# Altium project Khoi_Node.PrjPCB
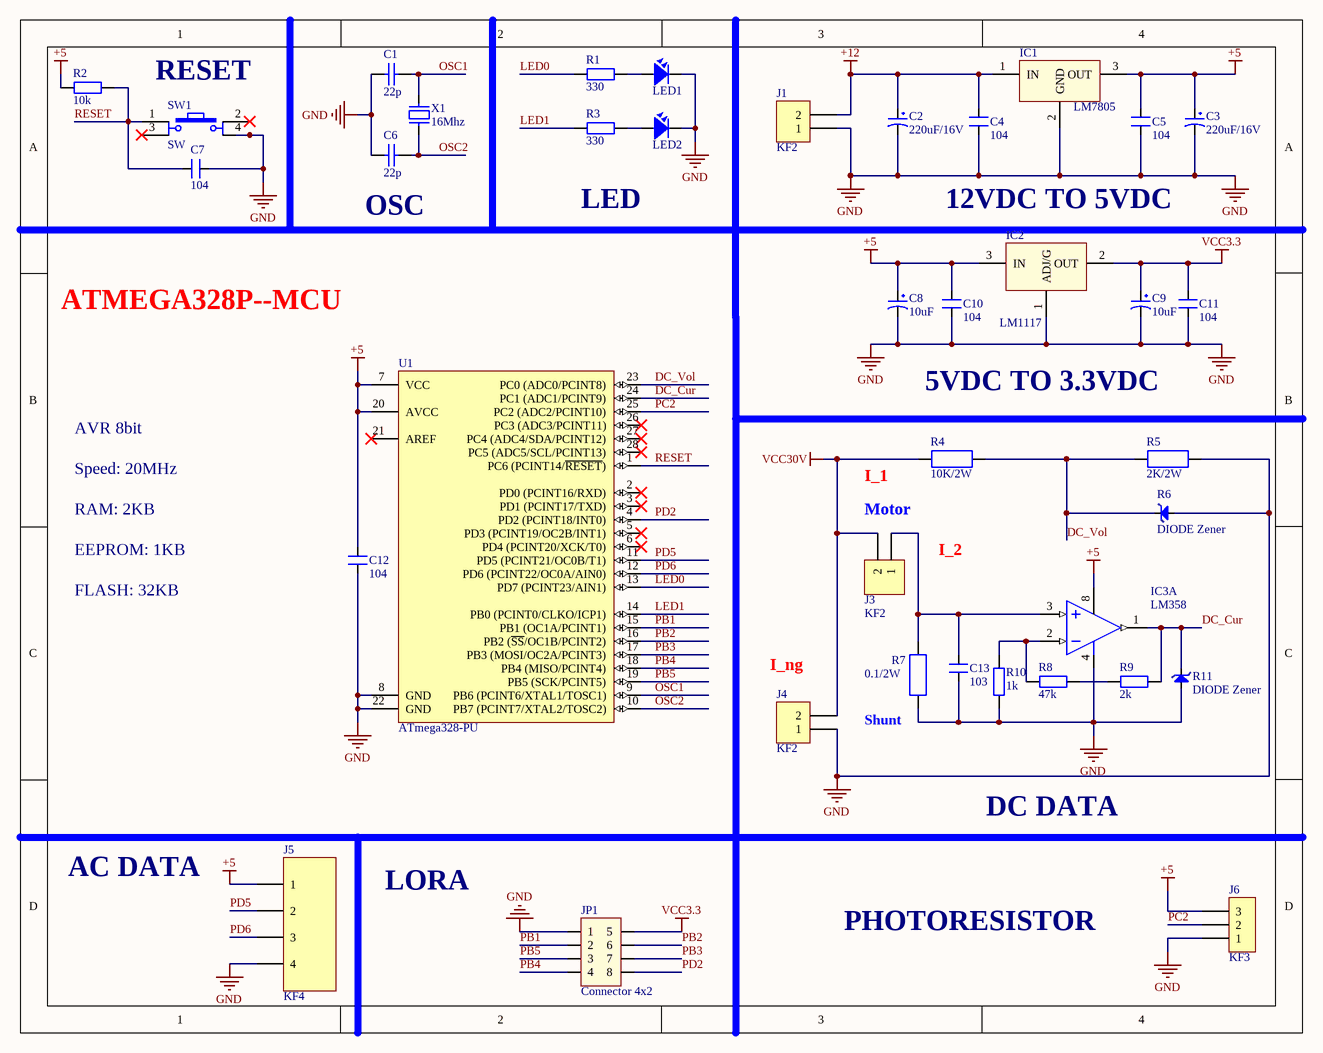
[diagram p0: File_Nguyen_ly.SchDoc]
1 sheet, 38 parts. Net scope: global (net labels, ports and power ports of the same name join across sheets).
Board file: File_Mach_In.PcbDoc

## Sheet File_Nguyen_ly.SchDoc
size A

### Parts
C1  value 22p  [Tu-pico]  (hidden comment: Capacitor Ceramic)
C2  220uF/16V  [CP1.5/3.4]
C3  220uF/16V  [CP1.5/3.4]
C4  104  [CN2]
C5  104  [CN2]
C6  value 22p  [Tu-pico]  (hidden comment: Capacitor Ceramic)
C7  104  [CN2]
C8  10uF  [CP1/2]
C9  10uF  [CP1/2]
C10  104  [CN2]
C11  104  [CN2]
C12  104  [CN2]
C13  103  [CN1.5]
IC1  LM7805  [QTO-220]
IC2  LM1117  [SOT223-4N]
IC3  LM358  [DIP8/W0.3]  (part A of 2)
J1  KF2  [KF2-5.08]
J3  KF2  [KF2-5.08]
J4  KF2  [KF2-5.08]
J5  KF4  [KF4-5]
J6  KF3  [KF3-5.08]
JP1  Connector 4x2  [JP4x2]
LED1  LED  [LED-5-Yellow]  (value not drawn)
LED2  LED  [LED-5-BLUE]  (value not drawn)
R1  330  [R1/4W]
R2  10k  [R1/4W]
R3  330  [R1/4W]
R4  10K/2W  [R2W]
R5  2K/2W  [R2W]
R6  DIODE Zener  [DIO-2A-ZEN]
R7  0.1/2W  [R2W]
R8  47k  [R1/4W]
R9  2k  [R1/4W]
R10  1k  [R1/4W]
R11  DIODE Zener  [DIO-2A-ZEN]
SW1  SW  [SW4]
U1  ATmega328-PU  [DIP28]
X1  16Mhz  [XT2]

### Nets
+5: C3.1 C5.2 C8.1 C10.2 C12.2 IC1.3(OUT) IC2.3(IN) IC3.8(+V) J5.1 J6.3 R2.2 U1.7(VCC) U1.20(AVCC)
+12: C2.1 C4.2 IC1.1(IN) J1.2
GND: C1.1 C2.2 C3.2 C4.1 C5.1 C6.1 C7.2 C8.2 C9.2 C10.1 C11.1 C12.1 C13.1 IC1.2(GND) IC2.1(ADJ/G) IC3.4(-V) J1.1 J4.1 J5.4 J6.1 JP1.1 LED1.2 LED2.2 R5.1 R6.1(A) R7.1 R10.1 R11.1(A) SW1.4 U1.8(GND) U1.22(GND)
VCC3.3: C9.1 C11.2 IC2.2(OUT) JP1.5
VCC30V: J3.2 J4.2 R4.2
DC_Cur: IC3.1(OUT) R9.2 R11.2(K) U1.24(PC1_(ADC1/PCINT9))
DC_Vol: R4.1 R5.2 R6.2(K) U1.23(PC0_(ADC0/PCINT8))
LED0: R1.1 U1.13(PD7_(PCINT23/AIN1))
LED1: R3.1 U1.14(PB0_(PCINT0/CLKO/ICP1))
OSC1: C1.2 U1.9(PB6_(PCINT6/XTAL1/TOSC1)) X1.2
OSC2: C6.2 U1.10(PB7_(PCINT7/XTAL2/TOSC2)) X1.1
PB1: JP1.2 U1.15(PB1_(OC1A/PCINT1))
PB2: JP1.6 U1.16(PB2_(~{SS}/OC1B/PCINT2))
PB3: JP1.7 U1.17(PB3_(MOSI/OC2A/PCINT3))
PB4: JP1.4 U1.18(PB4_(MISO/PCINT4))
PB5: JP1.3 U1.19(PB5_(SCK/PCINT5))
PC2: J6.2 U1.25(PC2_(ADC2/PCINT10))
PD2: JP1.8 U1.4(PD2_(PCINT18/INT0))
PD5: J5.2 U1.11(PD5_(PCINT21/OC0B/T1))
PD6: J5.3 U1.12(PD6_(PCINT22/OC0A/AIN0))
RESET: C7.1 R2.1 SW1.1 U1.1(PC6_(PCINT14/~{RESET}))
NetC13_2: C13.2 IC3.3(IN+) J3.1 R7.2
NetIC3_2: IC3.2(IN-) R8.1 R10.2
NetLED1_1: LED1.1 R1.2
NetLED2_1: LED2.1 R3.2
NetR8_2: R8.2 R9.1

Not connected (* = marked no-connect by the designer): SW1 2* 3*; U1 2(PD0_(PCINT16/RXD))* 3(PD1_(PCINT17/TXD))* 5(PD3_(PCINT19/OC2B/INT1))* 6(PD4_(PCINT20/XCK/T0))* 21(AREF)* 26(PC3_(ADC3/PCINT11))* 27(PC4_(ADC4/SDA/PCINT12))* 28(PC5_(ADC5/SCL/PCINT13))*

### Notes on the sheet
- RESET
- (near C6) OSC
- LED
- 12VDC TO 5VDC
- ATMEGA328P--MCU
- AVR 8bit
- 5VDC TO 3.3VDC
- Speed: 20MHz
- RAM: 2KB
- Motor
- (near R4) I_1
- EEPROM: 1KB
- (near J3) I_2
- FLASH: 32KB
- (near J4) I_ng
- (near R7) Shunt
- DC DATA
- AC DATA
- LORA
- PHOTORESISTOR

### Library data of the parts
C1 C6 = CapCeramic: Capacitor; Published: 8-Jun-2000; LatestRevisionDate: 17-Jul-2002; LatestRevisionNote: Re-released for DXP Platform.; PackageReference: RAD-0.3; Publisher: Altium Limited
C2 C3 = CP3: Cap 100uF/35V - 470uF/16V; Value: 100uF/35V/50V; Description 1: 1000uF/6,3V - 470uF/16V - 330uF - 25V; Description 2: 220uF/35V - 100uF/50V - 63V - 4,7uF/200V; Description 3: 22uF => 33uF100V - 3,3uF => 4,7uF/250V; Description 4: 2,2uF =>3,3uF/350 - 2,2uF/400V - 1uF/450V
C4 C5 C7 C10-C12 = CN2: Cap np 104 => 105pF; Value: 0.1uF
C8 C9 = CP1: Cap P  0,1uF < 22uF , 16 - 50V; Value: 10uF/50V; Description 1: 10 => 220uF/6,3V/10V - 10uF => 100uF/16V; Description 2: 0,1uF => 33uF/50V - 10uF => 22uF/63V; Description 3: 0,47uF => 10uF/100V
C13 = CN1.5: Cap np 682pF => 104pF; Value: 0.01uF
IC1 = LM78xx: On ap +, from + 5 to + 24VDC; Value: LM7805
IC2 = LM1117: Available in 1.8V, 2.5V, 2.85V, 3.3V, 5V, and  Adjustable Versions; Value: LM317
IC3 = LM358: Low-Power Dual Operational Amplifier; Value: LM358
J1 J3 J4 = KF2: Manufacturer: Würth Elektronik eiSos GmbH; partNo: 691103110002; ComponentLink1 Description: Manufacturer; ComponentLink2 Description: Datasheet; NoPins: 2; Created Date: 29 October 2013; ComponentLink1URL: http://www.we-online.com; ComponentLink2URL: http://katalog.we-online.de/em/datasheet/6911031100xx.pdf; Created by: Karrer Zheng
J5 = KF4: Manufacturer: W¨¹rth Elektronik eiSos GmbH; PartNo: 691133710004; ComponentLink1 Description: Manufacturer; ComponentLink2 Description: Datasheet; NoPins: 4; ComponentLink1 URL: http://www.we-online.com; ComponentLink2 URL: http://katalog.we-online.de/em/datasheet/6911337100xx.pdf; Created By: Baojun Chen; Created Date: 4-Aug-15
J6 = KF3: Manufacturer: Würth Elektronik eiSos GmbH; partNo: 691103110003; ComponentLink1 Description: Manufacturer; ComponentLink2 Description: Datasheet; NoPins: 3; Created Date: 29 October 2013; ComponentLink1URL: http://www.we-online.com; ComponentLink2URL: http://katalog.we-online.de/em/datasheet/6911031100xx.pdf; Created by: Karrer Zheng
JP1 = JP4x2: Value: Connector 4x2
LED1 LED2 = LED: LED Single colour Green and Red; Value: LED 3 ly Single Colour
R1-R3 R8-R10 = R1/4W: Resistor 1/4W; Value: R1/4W - 1K
R4 R5 R7 = R2W: Resistor 2W; Value: R2W - 47
R6 R11 = DIODE Zener: Zenner
SW1 = SW4: Switch button 4 pin; Value: Button chip 4 pin
U1 = ATmega328-PU: 8-bit AVR Microcontroller, 32KB Flash, 1KB EEPROM, 2KB SRAM, 28-pin PDIP, Industrial Grade (-40°C to 85°C); Published: 1-Apr-2010; DatasheetVersion: revA, Jan-2010; PackageVersion: revB, Sep-2001; PackageReference: 28P3; Publisher: Altium Limited; PackageDescription: 28-lead (0.300"/7.62mm Wide) Plastic Dual Inline Package (PDIP); Supplier 1: Digi-Key; Supplier Part Number 1: ATMEGA328-PU-ND; Supplier 2: Mouser; Supplier Part Number 2: 556-ATMEGA328-PU; ComponentLink1Description: Manufacturer Link; ComponentLink1URL: http://www.atmel.com/products/avr/default.asp?; ComponentLink2Description: ATmega48A/48PA/88A/88PA/168A/168PA/328/328P Datasheet; ComponentLink2URL: http://www.atmel.com/dyn/resources/prod_documents/8271.pdf; ComponentLink3Description: ATmega48A/48PA/88A/88PA/168A/168PA/328/328P Summary; ComponentLink3URL: http://www.atmel.com/dyn/resources/prod_documents/8271S.pdf; ComponentLink4Description: Atmel.com Home; ComponentLink4URL: http://www.atmel.com
X1 = XT2: Crystal For all Crystal 2pin.; Value: 4Mhz